# EAGLE design moth_v1 (EAGLE 9.4.1)
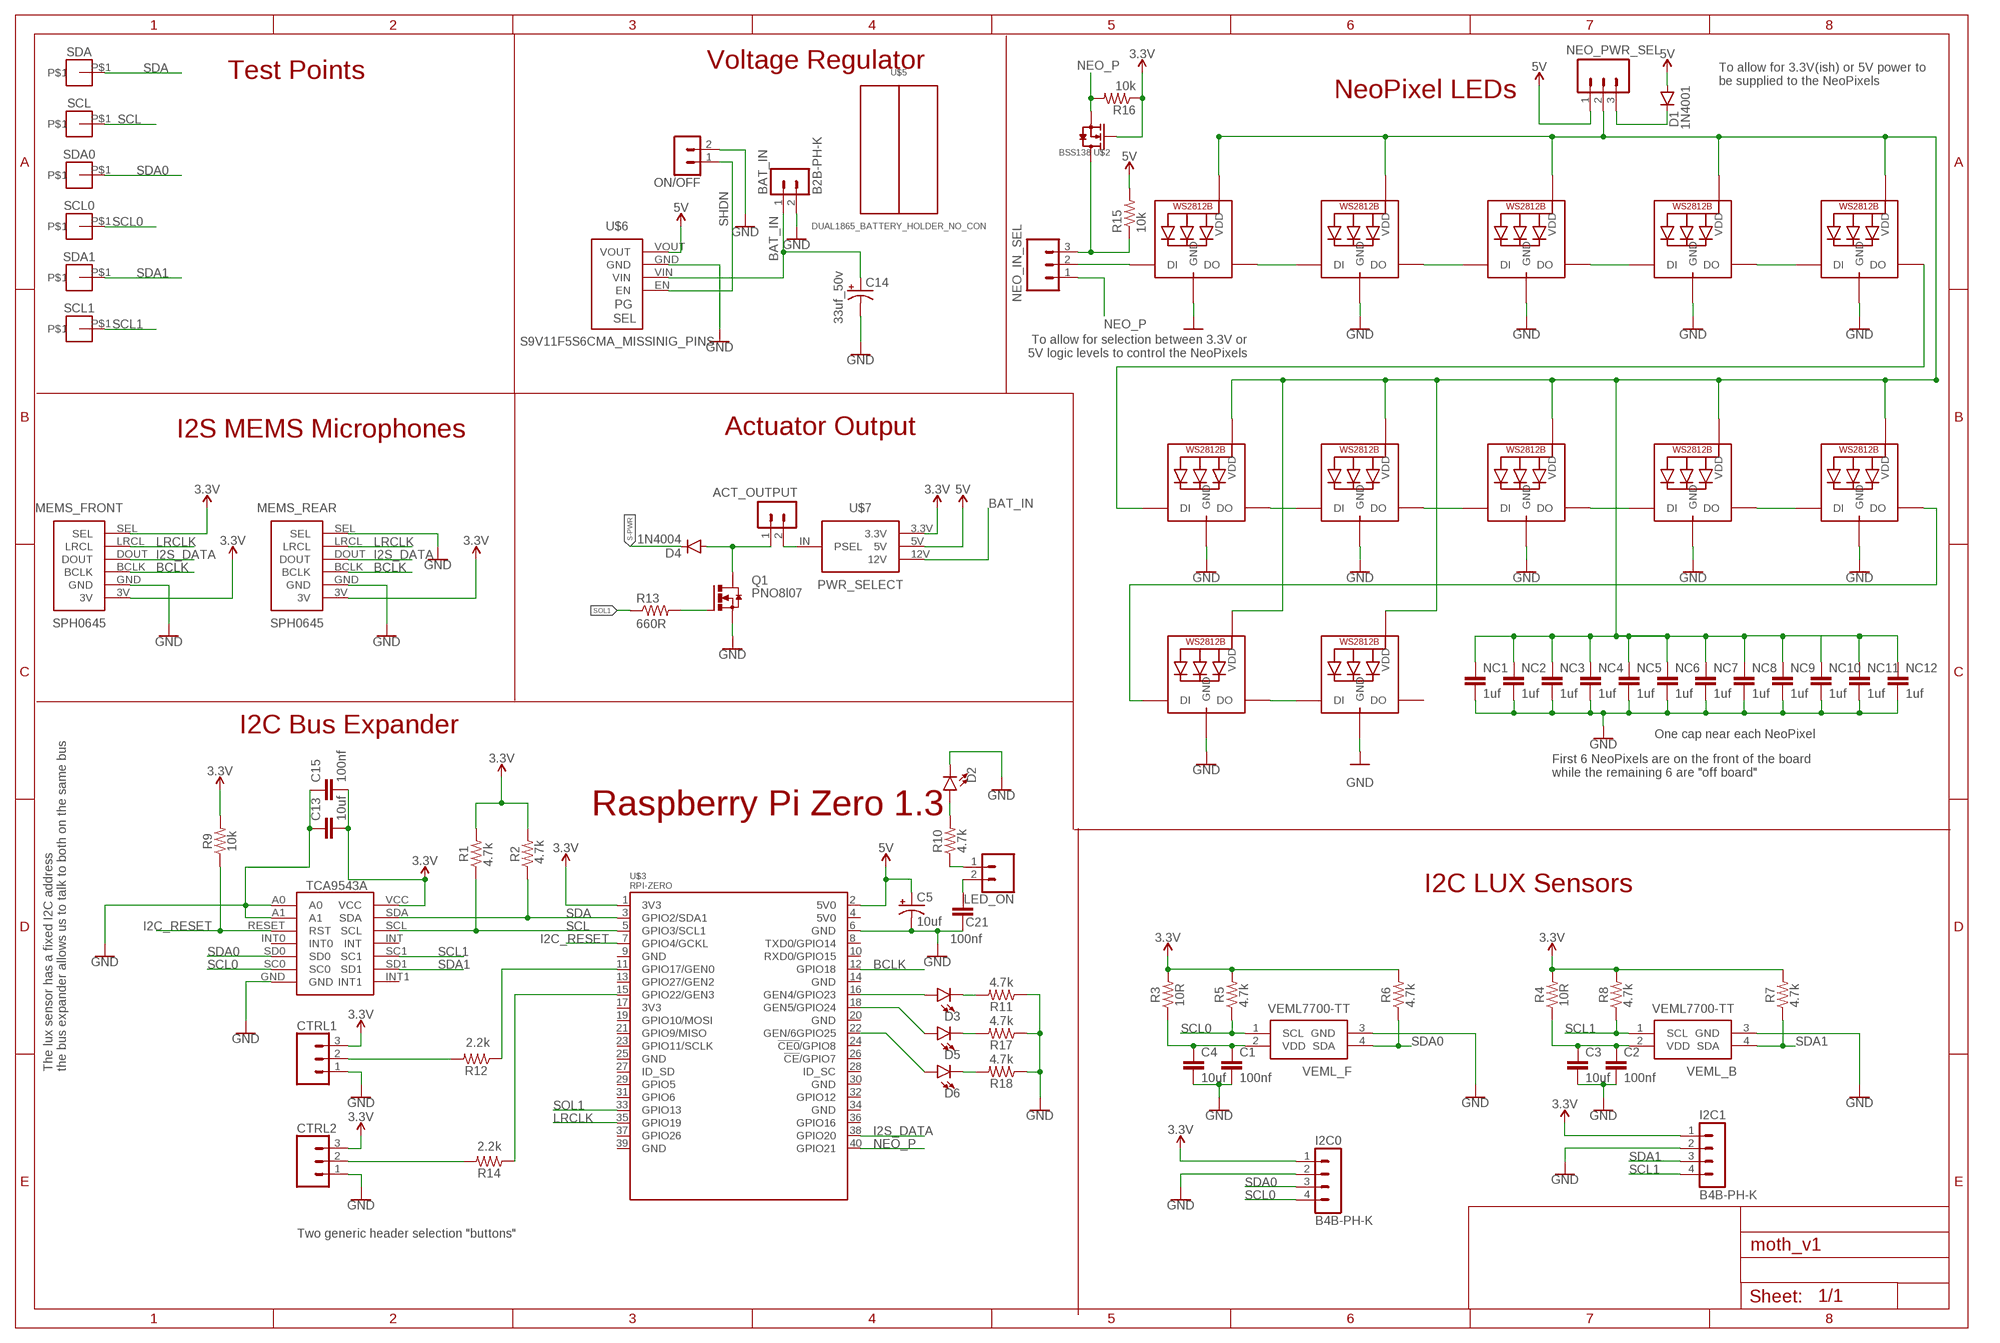
[diagram p0: schematic, sheet 1]

## Parts
ACT_OUTPUT  B2B-PH-K  [B2B-PH-K]
BAT_IN  B2B-PH-K  [B2B-PH-K]
C1  100nf  5.6PF-0603-50V-5%  [0603]
C2  100nf  5.6PF-0603-50V-5%  [0603]
C3  10uf  5.6PF-0603-50V-5%  [0603]
C4  10uf  5.6PF-0603-50V-5%  [0603]
C5  10uf  CPOL-USE2.5-6  [E2,5-6]
C13  10uf  5.6PF-0603-50V-5%  [0603]
C14  33uf_50v  CPOL-USE2-5  [E2-5]
C15  100nf  5.6PF-0603-50V-5%  [0603]
C21  100nf  5.6PF-0603-50V-5%  [0603]
CTRL1  CONN_03  [1X03]
CTRL2  CONN_03  [1X03]
D1  1N4001  DIODEPTH  [DIODE-1N4001]
D2  LED-FKIT-1206  [FKIT-LED-1206]
D3  LED-FKIT-1206  [FKIT-LED-1206]
D4  1N4004  DIODEPTH  [DIODE-1N4001]
D5  LED-FKIT-1206  [FKIT-LED-1206]
D6  LED-FKIT-1206  [FKIT-LED-1206]
I2C0  B4B-PH-K  [B4B-PH-K]
I2C1  B4B-PH-K  [B4B-PH-K]
LED_ON  CONN_021X02_NO_SILK  [1X02_NO_SILK]
MEMS_FRONT  SPH0645  SPH0645_MEMS_MICROPHONE  [SPH0645]
MEMS_REAR  SPH0645  SPH0645_MEMS_MICROPHONE  [SPH0645]
NC1  1uf  5.6PF-0603-50V-5%  [0603]
NC2  1uf  5.6PF-0603-50V-5%  [0603]
NC3  1uf  5.6PF-0603-50V-5%  [0603]
NC4  1uf  5.6PF-0603-50V-5%  [0603]
NC5  1uf  5.6PF-0603-50V-5%  [0603]
NC6  1uf  5.6PF-0603-50V-5%  [0603]
NC7  1uf  5.6PF-0603-50V-5%  [0603]
NC8  1uf  5.6PF-0603-50V-5%  [0603]
NC9  1uf  5.6PF-0603-50V-5%  [0603]
NC10  1uf  5.6PF-0603-50V-5%  [0603]
NC11  1uf  5.6PF-0603-50V-5%  [0603]
NC12  1uf  5.6PF-0603-50V-5%  [0603]
NEO_01  WS2812B_5050N  [WS2812B-NARROW]
NEO_02  WS2812B_5050N  [WS2812B-NARROW]
NEO_03  WS2812B_5050N  [WS2812B-NARROW]
NEO_04  WS2812B_5050N  [WS2812B-NARROW]
NEO_05  WS2812B_5050N  [WS2812B-NARROW]
NEO_06  WS2812B_5050N  [WS2812B-NARROW]
NEO_07  WS2812B_5050N  [WS2812B-NARROW]
NEO_08  WS2812B_5050N  [WS2812B-NARROW]
NEO_09  WS2812B_5050N  [WS2812B-NARROW]
NEO_10  WS2812B_5050N  [WS2812B-NARROW]
NEO_11  WS2812B_5050N  [WS2812B-NARROW]
NEO_12  WS2812B_5050N  [WS2812B-NARROW]
NEO_IN_SEL  CONN_03  [1X03]
NEO_PWR_SEL  CONN_03  [1X03]
ON/OFF  B2B-PH-K  [B2B-PH-K]
Q1  PNO8l07  IRF3704-H  [TO220BH]
R1  4.7k  R-US_0207/10  [0207/10]
R2  4.7k  R-US_0207/10  [0207/10]
R3  10R  4.7KOHM-0603-1/10W-1%  [0603]
R4  10R  4.7KOHM-0603-1/10W-1%  [0603]
R5  4.7k  R-US_0207/10  [0207/10]
R6  4.7k  R-US_0207/10  [0207/10]
R7  4.7k  R-US_0207/10  [0207/10]
R8  4.7k  R-US_0207/10  [0207/10]
R9  10k  R-US_0207/10  [0207/10]
R10  4.7k  4.7KOHM-0603-1/10W-1%  [0603]
R11  4.7k  4.7KOHM-0603-1/10W-1%  [0603]
R12  2k  R-US_0207/10  [0207/10]
R13  660R  R-US_0207/10  [0207/10]
R14  2k  R-US_0207/10  [0207/10]
R15  10k  10KOHM-0603-1/10W-1%  [0603]
R16  10k  10KOHM-0603-1/10W-1%  [0603]
R17  4.7k  4.7KOHM-0603-1/10W-1%  [0603]
R18  4.7k  4.7KOHM-0603-1/10W-1%  [0603]
SCL  TEST_POINT_LARGE  [TEST_POINT_LARGE]
SCL0  TEST_POINT_LARGE  [TEST_POINT_LARGE]
SCL1  TEST_POINT_LARGE  [TEST_POINT_LARGE]
SDA  TEST_POINT_LARGE  [TEST_POINT_LARGE]
SDA0  TEST_POINT_LARGE  [TEST_POINT_LARGE]
SDA1  TEST_POINT_LARGE  [TEST_POINT_LARGE]
U$1  TCA9543A  [SO14]
U$2  BSS138  [SOT23-3]
U$3  RPI-ZERO  [RASPBERRYPI_BASTELSTUBE_V13_RASPI_BOARD_B+_FULL]
U$5  DUAL1865_BATTERY_HOLDER_NO_CON  [DUAL_18650_BAT_HOLDER_NO_CON]
U$6  S9V11F5S6CMA_MISSINIG_PINS  [S9V11F3S5CMA_MISSING_PINS]
U$7  PWR_SELECT  [PWR_SELECT_PINOUT]
VEML_B  VEML7700-TT  [VEML7700]
VEML_F  VEML7700-TT  [VEML7700]

## Nets
3.3V: C13.2 C15.2 CTRL1.3 CTRL2.3 I2C0.1 I2C1.1 MEMS_FRONT.3V MEMS_FRONT.SEL MEMS_REAR.3V R1.2 R2.2 R3.2 R4.2 R5.2 R6.2 R7.2 R8.2 R9.2 R16.1 U$1.VCC U$2.1(G) U$3.1(3V3) U$7.3.3V
5V: C5.+ D1.A NEO_PWR_SEL.1 R15.2 U$3.2(5V0) U$6.VOUT U$7.5V
BAT_IN: BAT_IN.1 C14.+ U$6.VIN U$7.12V
BCLK: MEMS_FRONT.BCLK MEMS_REAR.BCLK U$3.12(GPIO18)
GND: BAT_IN.2 C1.2 C2.2 C3.2 C4.2 C5.- C13.1 C14.- C15.1 C21.1 CTRL1.1 CTRL2.1 D2.C I2C0.2 I2C1.2 MEMS_FRONT.GND MEMS_REAR.GND MEMS_REAR.SEL NC1.2 NC2.2 NC3.2 NC4.2 NC5.2 NC6.2 NC7.2 NC8.2 NC9.2 NC10.2 NC11.2 NC12.2 NEO_01.3-GND(GND) NEO_02.3-GND(GND) NEO_03.3-GND(GND) NEO_04.3-GND(GND) NEO_05.3-GND(GND) NEO_06.3-GND(GND) NEO_07.3-GND(GND) NEO_08.3-GND(GND) NEO_09.3-GND(GND) NEO_10.3-GND(GND) NEO_11.3-GND(GND) NEO_12.3-GND(GND) ON/OFF.2 Q1.S R11.1 R17.1 R18.1 U$1.A0 U$1.A1 U$1.GND U$3.6(GND) U$6.GND VEML_B.3(GND) VEML_F.3(GND)
I2C_RESET: R9.1 U$1.RESET(RST) U$3.7(GPIO4/GCKL)
I2S_DATA: MEMS_FRONT.DOUT MEMS_REAR.DOUT U$3.38(GPIO20)
LRCLK: MEMS_FRONT.LRCL MEMS_REAR.LRCL U$3.35(GPIO19)
N$1: C1.1 C4.1 R3.1 VEML_F.2(VDD)
N$2: C2.1 C3.1 R4.1 VEML_B.2(VDD)
N$3: R12.1 U$3.11(GPIO17/GEN0)
N$4: NEO_02.2-DOUT(DO) NEO_03.4-DIN(DI)
N$5: NEO_05.2-DOUT(DO) NEO_06.4-DIN(DI)
N$6: NEO_11.2-DOUT(DO) NEO_12.4-DIN(DI)
N$8: NEO_04.2-DOUT(DO) NEO_05.4-DIN(DI)
N$9: NC1.1 NC2.1 NC3.1 NC4.1 NC5.1 NC6.1 NC7.1 NC8.1 NC9.1 NC10.1 NC11.1 NC12.1 NEO_01.1-VDD(VDD) NEO_02.1-VDD(VDD) NEO_03.1-VDD(VDD) NEO_04.1-VDD(VDD) NEO_05.1-VDD(VDD) NEO_06.1-VDD(VDD) NEO_07.1-VDD(VDD) NEO_08.1-VDD(VDD) NEO_09.1-VDD(VDD) NEO_10.1-VDD(VDD) NEO_11.1-VDD(VDD) NEO_12.1-VDD(VDD) NEO_PWR_SEL.2
N$10: NEO_03.2-DOUT(DO) NEO_04.4-DIN(DI)
N$11: NEO_07.2-DOUT(DO) NEO_08.4-DIN(DI)
N$12: NEO_08.2-DOUT(DO) NEO_09.4-DIN(DI)
N$13: NEO_09.2-DOUT(DO) NEO_10.4-DIN(DI)
N$14: NEO_10.2-DOUT(DO) NEO_11.4-DIN(DI)
N$15: R14.1 U$3.15(GPIO22/GEN3)
N$16: D2.A R10.2
N$17: CTRL2.2 R14.2
N$18: CTRL1.2 R12.2
N$19: Q1.G R13.2
N$20: ACT_OUTPUT.1 D4.A Q1.D
N$23: NEO_06.2-DOUT(DO) NEO_07.4-DIN(DI)
N$24: C21.2 LED_ON.2
N$25: D1.C NEO_PWR_SEL.3
N$26: NEO_IN_SEL.3 R15.1 U$2.3(D)
N$27: LED_ON.1 R10.1
N$28: D3.C R11.2
N$29: D5.C R17.2
N$30: D6.C R18.2
N$32: D3.A U$3.16(GEN4/GPIO23)
N$33: D5.A U$3.18(GEN5/GPIO24)
N$34: D6.A U$3.22(GEN/6GPIO25)
NEO_P: NEO_IN_SEL.1 R16.2 U$2.2(S) U$3.40(GPIO21)
NEO_P1: NEO_01.2-DOUT(DO) NEO_02.4-DIN(DI)
NEO_P99: NEO_01.4-DIN(DI) NEO_IN_SEL.2
S-PWR: ACT_OUTPUT.2 D4.C U$7.IN(PSEL)
SCL: R1.1 SCL.P$1 U$1.SCL U$3.5(GPIO3/SCL1)
SCL0: I2C0.4 R5.1 SCL0.P$1 U$1.SC0 VEML_F.1(SCL)
SCL1: I2C1.4 R8.1 SCL1.P$1 U$1.SC1 VEML_B.1(SCL)
SDA: R2.1 SDA.P$1 U$1.SDA U$3.3(GPIO2/SDA1)
SDA0: I2C0.3 R6.1 SDA0.P$1 U$1.SD0 VEML_F.4(SDA)
SDA1: I2C1.3 R7.1 SDA1.P$1 U$1.SD1 VEML_B.4(SDA)
SHDN: ON/OFF.1 U$6.EN
SOL1: R13.1 U$3.33(GPIO13)
Unconnected: NEO_12.2-DOUT(DO) U$1.INT U$1.INT0 U$1.INT1 U$3.4(5V0) U$3.8(TXD0/GPIO14) U$3.9(GND) U$3.10(RXD0/GPIO15) U$3.13(GPIO27/GEN2) U$3.14(GND) U$3.17(3V3) U$3.19(GPIO10/MOSI) U$3.20(GND) U$3.21(GPIO9/MISO) U$3.23(GPIO11/SCLK) U$3.24(!CE0!/GPIO8) U$3.25(GND) U$3.26(!CE!/GPIO7) U$3.27(ID_SD) U$3.28(ID_SC) U$3.29(GPIO5) U$3.30(GND) U$3.31(GPIO6) U$3.32(GPIO12) U$3.34(GND) U$3.36(GPIO16) U$3.37(GPIO26) U$3.39(GND)

## Notes on the sheet
- Voltage Regulator
- Test Points
- To allow for 3.3V(ish) or 5V power to 
  be supplied to the NeoPixels
- NeoPixel LEDs
- To allow for selection between 3.3V or
  5V logic levels to control the NeoPixels
- I2S MEMS Microphones | Actuator Output
- 660R
- I2C Bus Expander
- One cap near each NeoPixel
- First 6 NeoPixels are on the front of the board
  while the remaining 6 are "off board"
- Raspberry Pi Zero 1.3
- 10k
- 4.7k | 4.7k
- I2C LUX Sensors
- 4.7k | 4.7k | 4.7k | 4.7k
- 2.2k
- The lux sensor has a fixed I2C address
  the bus expander allows us to talk to both on the same bus
- 2.2k
- Two generic header selection "buttons"

## Library data of the parts
ACT_OUTPUT BAT_IN ON/OFF = con-jst-ph:B2B-PH-K: HEADER
C1-C4 C13 C15 C21 NC1-NC12 = SparkFun-Capacitors:5.6PF: 5.6pF ceramic capacitors A capacitor is a passive two-terminal electrical component used to store electrical energy temporarily in an electric field.; PROD_ID: CAP-12456; VALUE: 5.6PF
C5 C14 = adafruit:CPOL-US: POLARIZED CAPACITOR, American symbol
CTRL1 CTRL2 NEO_IN_SEL NEO_PWR_SEL = SparkFun-Connectors:CONN_03: Multi connection point. Often used as Generic Header-pin footprint for 0.1 inch spaced/style header connections On any of the 0.1 inch spaced packages, you can populate with these: Break Away Headers - Straight <https://www.sparkfun.com/products/116> (PRT-00116) Break Away Male Headers - Right Angle <https://www.sparkfun.com/products/553> (PRT-00553) Female Headers <https://www.sparkfun.com/products/115> (PRT-00115) Break Away Headers - Machine Pin <https://www.sparkfun.com/products/117> (PRT-00117) Break Away Female Headers - Swiss Machine Pin <https://www.sparkfun.com/products/743> (PRT-00743) Stackable Header - 3 Pin (Female, 0.1") <https://www.sparkfun.com/products/13875> (PRT-13875) For SCREWTERMINALS and SPRING TERMINALS visit here: Screw Terimnals on SparkFun.com <https://www.sparkfun.com/search/results?term=Screw+Terminals> (5mm/3.5mm/2.54mm spacing) This device is also useful as a general connection point to wire up your design to another part of your project. Our various solder wires solder well into these plated through hole pads. Hook-Up Wire - Assortment (Stranded, 22 AWG) <https://www.sparkfun.com/products/11375> (PRT-11375) Hook-Up Wire - Assortment (Solid Core, 22 AWG) <https://www.sparkfun.com/products/11367> (PRT-11367) View the entire wire category on our website here <https://www.sparkfun.com/categories/141> Special notes: Molex polarized connector foot print use with SKU : PRT-08232 with associated crimp pins and housings.
D1 D4 = SparkFun-DiscreteSemi:DIODE: Diode These are standard reverse protection diodes and small signal diodes. SMA package can handle up to about 1A. SOD-323 can handle about 200mA. What the SOD-323 package when ordering, there are some mfgs out there that are 5-pin packages.
D2 D3 D5 D6 = SparkFun-LED:LED: LED (Generic) Standard schematic elements and footprints for 5mm, 3mm, 1206, and 0603 sized LEDs. Generic LEDs with no color specified.
I2C0 I2C1 = con-jst-ph:B4B-PH-K: HEADER
LED_ON = SparkFun-Connectors:CONN_02: Multi connection point. Often used as Generic Header-pin footprint for 0.1 inch spaced/style header connections On any of the 0.1 inch spaced packages, you can populate with these: Break Away Headers - Straight <https://www.sparkfun.com/products/116> (PRT-00116) Break Away Male Headers - Right Angle <https://www.sparkfun.com/products/553> (PRT-00553) Female Headers <https://www.sparkfun.com/products/115> (PRT-00115) Break Away Headers - Machine Pin <https://www.sparkfun.com/products/117> (PRT-00117) Break Away Female Headers - Swiss Machine Pin <https://www.sparkfun.com/products/743> (PRT-00743) For SCREWTERMINALS and SPRING TERMINALS visit here: Screw Terimnals on SparkFun.com <https://www.sparkfun.com/search/results?term=Screw+Terminals> (5mm/3.5mm/2.54mm spacing) This device is also useful as a general connection point to wire up your design to another part of your project. Our various solder wires solder well into these plated through hole pads. Hook-Up Wire - Assortment (Stranded, 22 AWG) <https://www.sparkfun.com/products/11375> (PRT-11375) Hook-Up Wire - Assortment (Solid Core, 22 AWG) <https://www.sparkfun.com/products/11367> (PRT-11367) View the entire wire category on our website here <https://www.sparkfun.com/categories/141> Special notes: Molex polarized connector foot print use with: PRT-08233 with associated crimp pins and housings. 2.54_SCREWTERM for use with PRT-10571. 3.5mm Screw Terminal footprints for PRT-08084 5mm Screw Terminal footprints for use with PRT-08432
MEMS_FRONT MEMS_REAR = nathans-custom-parts:SPH0645_MEMS_MICROPHONE
NEO_01-NEO_09 NEO_10-NEO_12 = adafruit:WS2812B
Q1 = transistor-power:IRF3704: SMPS MOSFET HEXFET® Power MOSFET Source: http://www.irf.com/product-info/datasheets/data/irf3704.pdf
R1 R2 R5-R9 R12-R14 = adafruit:R-US_: RESISTOR, American symbol
R3 R4 = SparkFun-Resistors:4.7KOHM: 4.7kΩ resistor A resistor is a passive two-terminal electrical component that implements electrical resistance as a circuit element. Resistors act to reduce current flow, and, at the same time, act to lower voltage levels within circuits. - Wikipedia; PROD_ID: RES-07857; VALUE: 4.7k
R10 R11 R17 R18 = SparkFun-Resistors:4.7KOHM: 4.7kΩ resistor A resistor is a passive two-terminal electrical component that implements electrical resistance as a circuit element. Resistors act to reduce current flow, and, at the same time, act to lower voltage levels within circuits. - Wikipedia; PROD_ID: RES-07857
R15 R16 = SparkFun-Resistors:10KOHM: 10kΩ resistor A resistor is a passive two-terminal electrical component that implements electrical resistance as a circuit element. Resistors act to reduce current flow, and, at the same time, act to lower voltage levels within circuits. - Wikipedia; PROD_ID: RES-00824
SCL SCL0 SCL1 SDA SDA0 SDA1 = nathans-custom-parts:TEST_POINT_LARGE
U$1 = nathans-custom-parts:TCA9543A
U$2 = nathans-custom-parts:BSS138
U$3 = RPI-Zero:RPI-ZERO
U$5 = nathans-custom-parts:DUAL1865_BATTERY_HOLDER_NO_CON
U$6 = nathans-custom-parts:S9V11F5S6CMA_MISSINIG_PINS
U$7 = nathans-custom-parts:PWR_SELECT
VEML_B VEML_F = VEML7700-TT:VEML7700-TT: 16Bit Ambient Light Sensor I2C 6.8x2.3mm Source: Datasheet <https://www.arrow.com/en/products/veml7700-tt/vishay>; DESCRIPTION: 16Bit Ambient Light Sensor I2C 6.8x2.3mm; HEIGHT: mm; MANUFACTURER_NAME: Vishay; MANUFACTURER_PART_NUMBER: VEML7700-TT; MOUSER_PART_NUMBER: 78-VEML7700-TT; MOUSER_PRICE-STOCK: https://www.mouser.com/Search/Refine.aspx?Keyword=78-VEML7700-TT; RS_PART_NUMBER: 1226791P; RS_PRICE-STOCK: http://uk.rs-online.com/web/p/products/1226791P

## Net classes
0 default: width 0.203 mm, drill 0.254 mm, clearance 0.203 mm

## Board
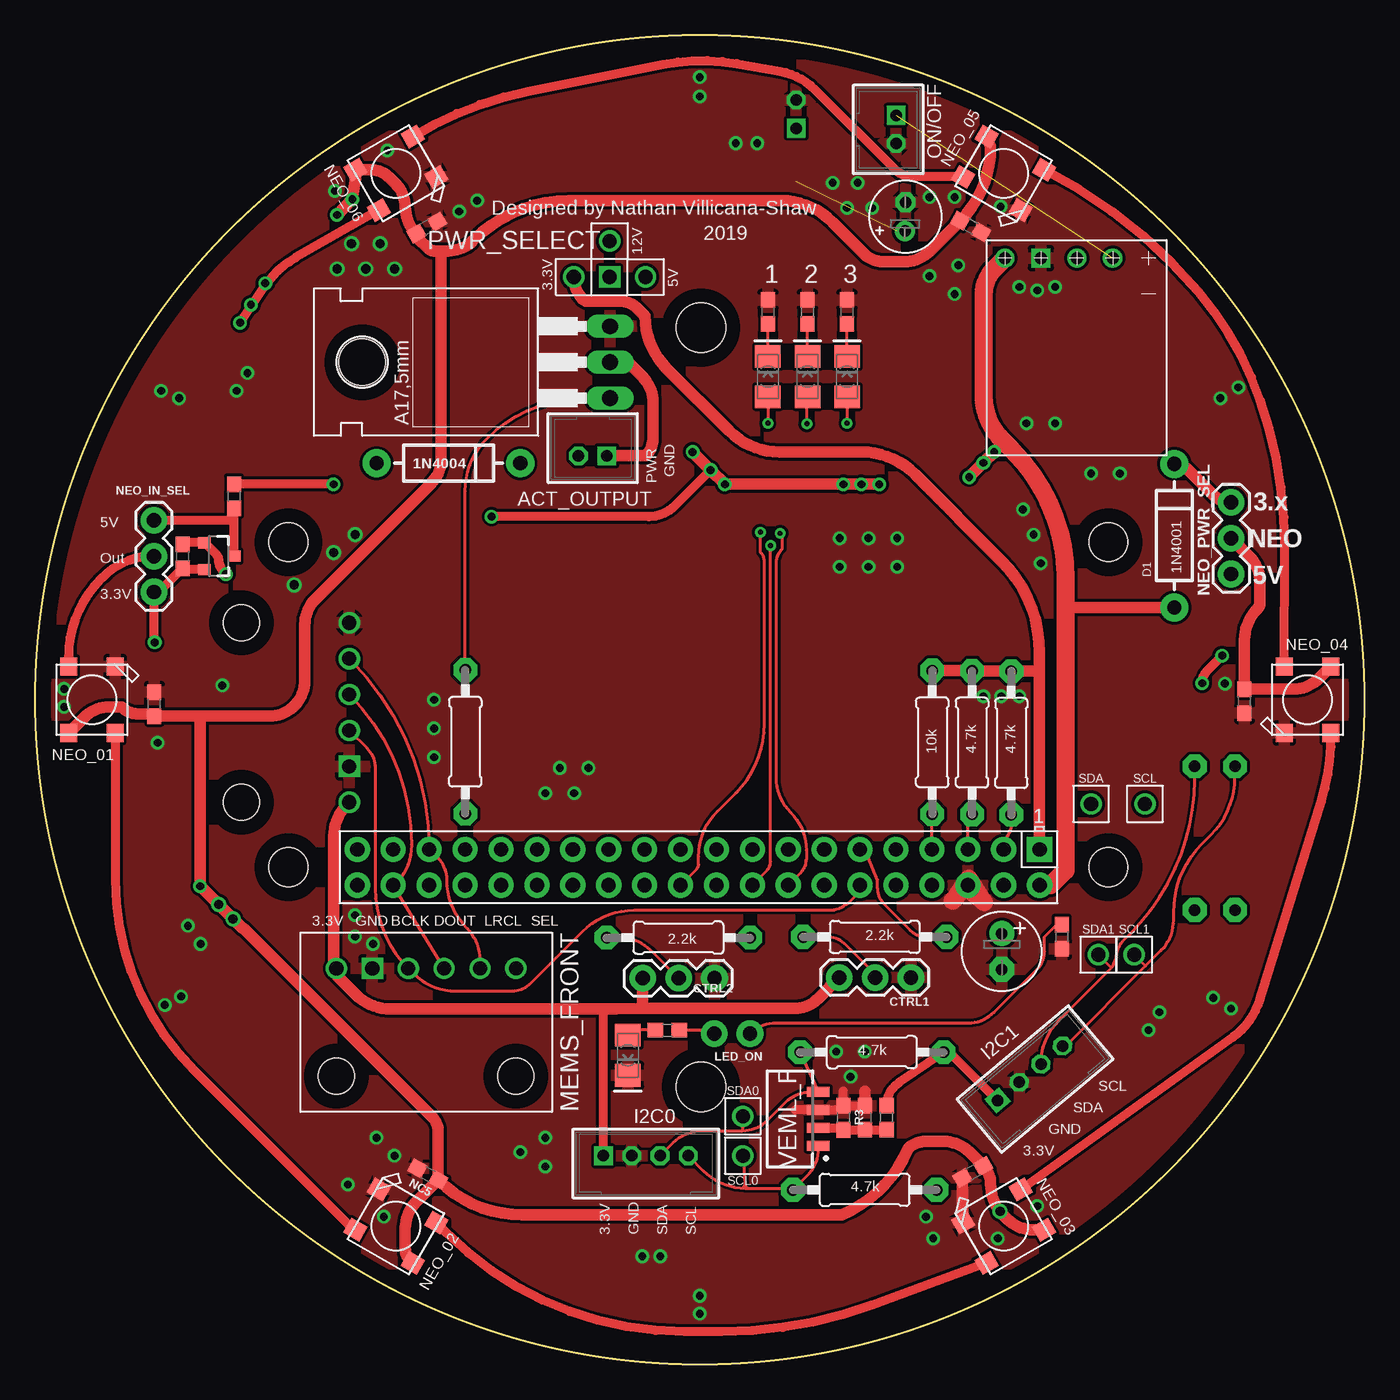
[diagram p1: board, top side]
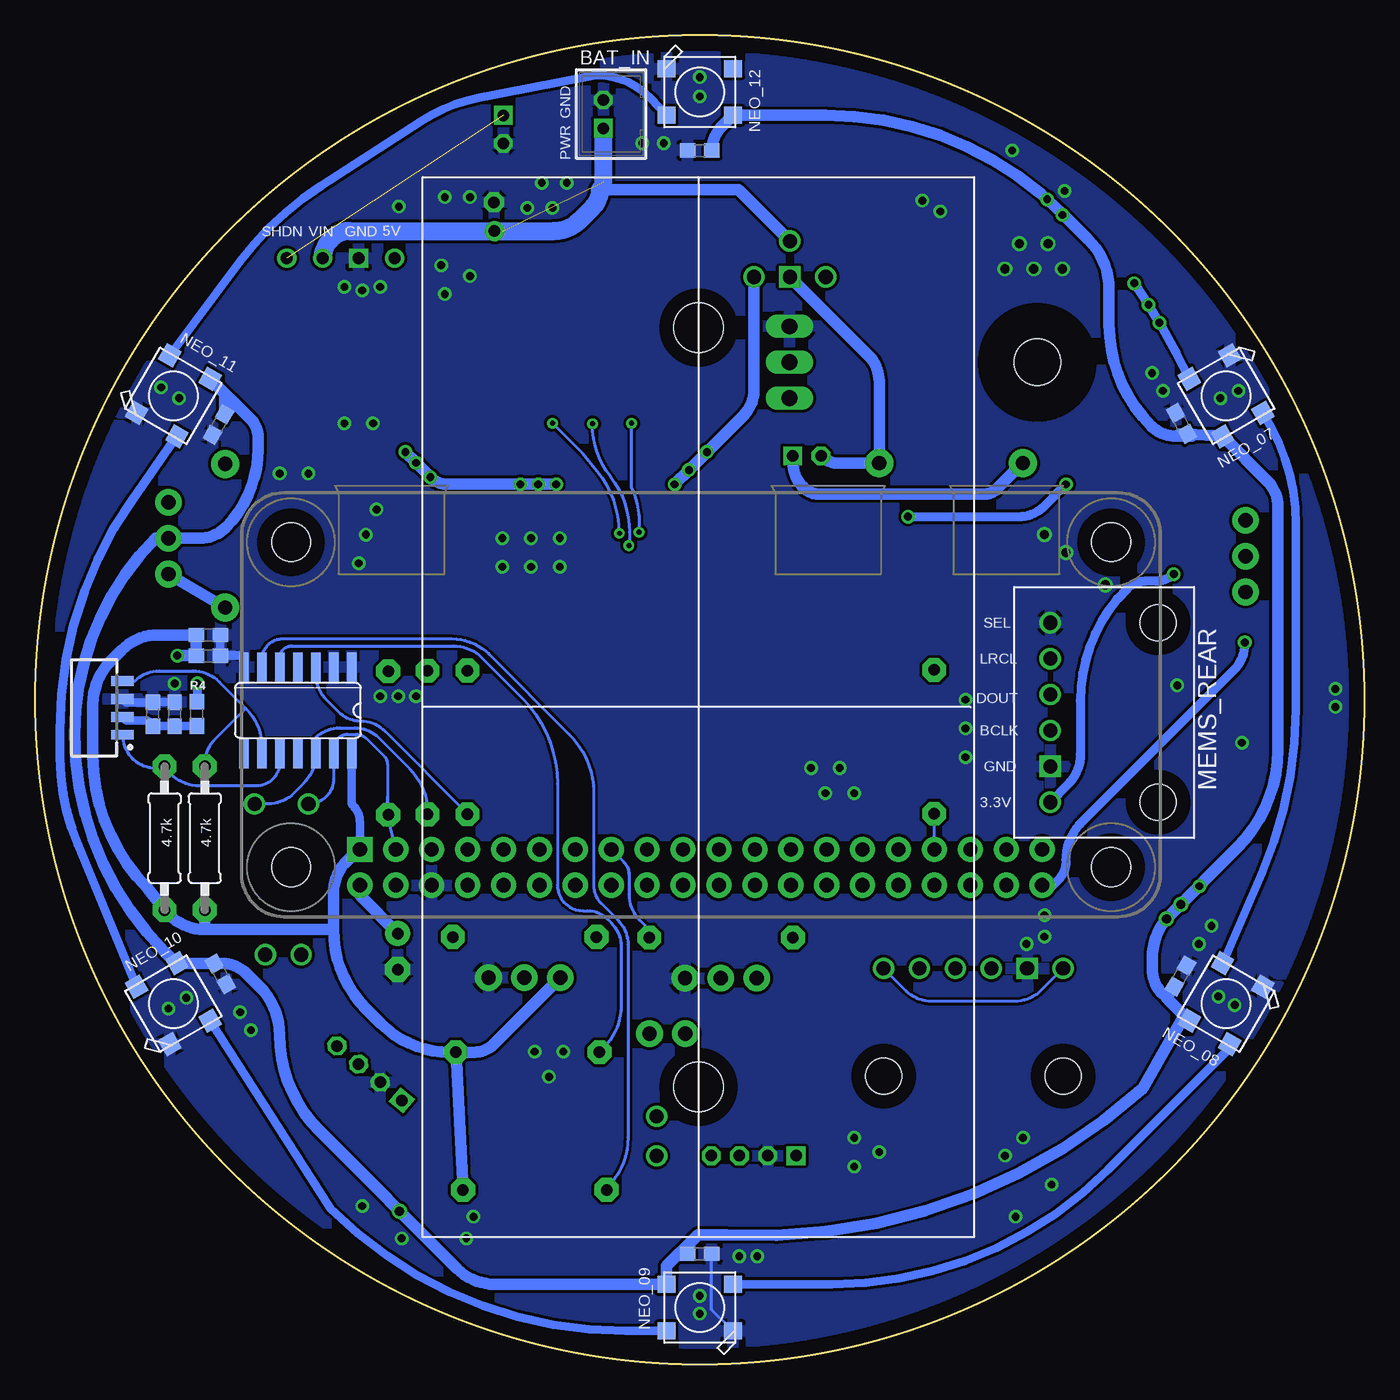
[diagram p2: board, bottom side, seen from below]

Size 94 x 94 mm. Coordinates in mm from the lower left corner, seen from the top.
Outline: circle at 47,47 radius 47
Copper layers (1*16): Top 0.035mm / dielectric 1.5mm / Bottom 0.035mm
Design rules "PCBway *": minimum track width 6mil, minimum drill 0.3mm, track to track 0.205mm, track to pad 0.205mm, pad to pad 0.205mm, via to via 0.205mm, smd to smd 8mil, copper to edge 40mil, drill to drill 8mil, minimum pad ring 10mil, minimum via ring 8mil, stop-mask expansion 4mil, vias tented up to drill 25mil, thermal gap 10mil

### Footprints (pad centres in the part's own frame; a part is rotated, then mirrored left to right if it is on the bottom)
B2B-PH-K = drill 0.813 square: 1 -1,0 | drill 0.813 octagon: 2 1,0
0603 = smd 1.1 x 1: 1 -0.85,0; 2 0.85,0
E2,5-6 = drill 0.813 pad 1.778: + -1.27,0 | drill 0.813 pad 1.778 octagon: - 1.27,0
E2-5 = drill 0.813 pad 1.422: + -1.016,0 | drill 0.813 pad 1.422 octagon: - 1.016,0
1X03 = drill 1.016 pad 1.88: 1 0,0; 2 2.54,0; 3 5.08,0
DIODE-1N4001 = drill 1 pad 1.981: A -5.08,0; C 5.08,0
FKIT-LED-1206 = smd 1.6 x 1.803: A -1.422,0; C 1.422,0
B4B-PH-K = drill 0.813 square: 1 -3,0 | drill 0.813 octagon: 2 -1,0; 3 1,0; 4 3,0
1X02_NO_SILK = drill 1.016 pad 1.88: 1 0,0; 2 2.54,0
SPH0645 = drill 1: 3V 12.7,0; BCLK 7.62,0; DOUT 5.08,0; LRCL 2.54,0; SEL 0,0 | drill 1 square: GND 10.16,0 | hole 2.54: 0,7.62; 12.7,7.62
WS2812B-NARROW = smd 1.3 x 1.2: 1-VDD 2.35,-1.65; 2-DOUT 2.35,1.65; 3-GND -2.35,1.65; 4-DIN -2.35,-1.65
TO220BH = drill 1.118 long: D 0,-6.35; G -2.54,-6.35; S 2.54,-6.35 | hole 3.302: 0,11.176
0207/10 = drill 0.813 pad 1.676 octagon: 1 -5.08,0; 2 5.08,0
TEST_POINT_LARGE = drill 1: P$1 0,0
SO14 = smd 0.66 x 2.032: A0 -3.81,-3.073; A1 -2.54,-3.073; GND 3.81,-3.073; INT 0,3.073; INT0 0,-3.073; INT1 3.81,3.073; RESET -1.27,-3.073; SC0 2.54,-3.073; SC1 1.27,3.073; SCL -1.27,3.073; SD0 1.27,-3.073; SD1 2.54,3.073; SDA -2.54,3.073; VCC -3.81,3.073
SOT23-3 = smd 0.8 x 0.9: 1 -0.95,-1; 2 0.95,-1; 3 0,1.1
RASPBERRYPI_BASTELSTUBE_V13_RASPI_BOARD_B+_FULL = drill 1 pad 1.778 square: 1 8.37,25.23 | drill 1 pad 1.778: 2 8.37,27.77; 3 10.91,25.23; 4 10.91,27.77; 5 13.45,25.23; 6 13.45,27.77; 7 15.99,25.23; 8 15.99,27.77; 9 18.53,25.23; 10 18.53,27.77; 11 21.07,25.23; 12 21.07,27.77; 13 23.61,25.23; 14 23.61,27.77; 15 26.15,25.23; 16 26.15,27.77; 17 28.69,25.23; 18 28.69,27.77; 19 31.23,25.23; 20 31.23,27.77; 21 33.77,25.23; 22 33.77,27.77; 23 36.31,25.23; 24 36.31,27.77; 25 38.85,25.23; 26 38.85,27.77; 27 41.39,25.23; 28 41.39,27.77; 29 43.93,25.23; 30 43.93,27.77; 31 46.47,25.23; 32 46.47,27.77; 33 49.01,25.23; 34 49.01,27.77; 35 51.55,25.23; 36 51.55,27.77; 37 54.09,25.23; 38 54.09,27.77; 39 56.63,25.23; 40 56.63,27.77 | hole 2.75: 3.5,3.5; 3.5,26.5; 61.5,3.5; 61.5,26.5
DUAL_18650_BAT_HOLDER_NO_CON = hole 3.5: 19.674,64.255; 19.674,10.555
S9V11F3S5CMA_MISSING_PINS = drill 0.85: EN 0,0; VIN 2.54,0; VOUT 7.62,0 | drill 0.85 square: GND 5.08,0
PWR_SELECT_PINOUT = drill 1: 3.3V 0,5.08; 5V 0,0; 12V 2.54,2.54 | drill 1 square: IN 0,2.54
VEML7700 = smd 0.7 x 1.6: 1 1.495,-0.4; 2 2.765,-0.4; 3 4.035,-0.4; 4 5.305,-0.4

### Placement (x,y rotation side)
ACT_OUTPUT  39.42,64.26 180 top
BAT_IN  53.82,88.43 90 bottom
C1  58.69,17.43 90 top
C2  85.68,45.99 90 bottom
C3  84.13,45.99 90 bottom
C4  57.16,17.42 90 top
C5  68.36,29.19 270 top
C13  81.76,50.11 180 bottom
C14  61.53,81.17 89 top
C15  81.76,51.58 180 bottom
C21  72.61,30.24 90 top
CTRL1  61.94,27.35 180 top
CTRL2  48.05,27.29 180 top
D1  80.58,58.61 90 top
D2  41.92,21.85 270 top
D3  57.41,69.86 90 top
D4  29.23,63.73 0 top
D5  54.62,69.86 90 top
D6  51.83,69.86 90 top
I2C0  43.19,14.74 0 top
I2C1  70.37,20.58 40 top
LED_ON  48.02,23.38 0 top
MEMS_FRONT  34,28 180 top
MEMS_REAR  22.21,52.45 270 bottom
NC1  85.53,46.91 270 top
NC2  66.17,80.48 331 top
NC3  27.69,80.4 30 top
NC4  8.42,46.69 90 top
NC5  27.76,13.44 151 top
NC6  66.31,13.6 210 top
NC7  81.04,66.47 240 bottom
NC8  47,85.86 180 bottom
NC9  12.93,66.55 119 bottom
NC10  12.99,27.46 60 bottom
NC11  47.01,7.81 0 bottom
NC12  80.92,27.61 300 bottom
NEO_01  4,47 270 top
NEO_02  25.5,9.76 330 top
NEO_03  68.5,9.76 30 top
NEO_04  90,47 90 top
NEO_05  68.5,84.24 150 top
NEO_06  25.5,84.24 210 top
NEO_07  9.76,68.5 300 bottom
NEO_08  9.76,25.5 240 bottom
NEO_09  47,4 180 bottom
NEO_10  84.24,25.5 120 bottom
NEO_11  84.24,68.5 60 bottom
NEO_12  47,90 0 bottom
NEO_IN_SEL  8.39,54.62 90 top
NEO_PWR_SEL  84.59,55.89 90 top
ON/OFF  60.89,87.35 270 top
Q1  34.3,70.88 90 top
R1  66.26,43.97 90 top
R2  69.04,43.94 90 top
R3  60.22,17.45 90 top
R4  82.57,45.99 90 bottom
R5  58.67,12.33 0 top
R6  59.17,22.07 0 top
R7  82.02,37.21 270 bottom
R8  84.86,37.21 270 bottom
R9  63.45,43.99 90 top
R10  44.71,23.63 180 top
R11  57.41,74.43 270 top
R12  59.38,30.22 180 top
R13  30.41,44.02 90 top
R14  45.49,30.17 180 top
R15  14.06,61.4 90 top
R16  10.42,57.16 270 top
R17  54.62,74.43 270 top
R18  51.83,74.43 270 top
SCL  78.5,39.63 0 top
SCL0  50.05,14.74 0 top
SCL1  77.73,28.97 0 top
SDA  74.69,39.63 0 top
SDA0  50.05,17.54 0 top
SDA1  75.19,28.97 0 top
U$1  75.43,46.24 180 bottom
U$2  12.96,57.16 270 top
U$3  79.41,61.65 180 top
U$5  27.42,83.88 180 bottom
U$6  76.21,78.24 180 top
U$7  43.17,76.91 90 top
VEML_B  88.23,43.03 90 bottom
VEML_F  54.98,13.95 90 top

### Tracks (layer width: path | path; a pad name or v marks a point on that pad's centre or on a via)
3.3V  (via drill 0.55)
  Top 0.635: R3.2 arc-56 61.06,19.88 R6.2 64.66,22.07 I2C1.1 | 82.93,49.1 arc45 v82.55,48.17 arc-45 82.93,49.1 | 82.93,49.1 v83.96,50.12 | R16.1 arc-45 10.66,58.11 U$2.1 12.82,57.25 arc-45 12.96,56.91 arc45 13.32,56.04 v13.47,55.89 | I2C0.1 40.19,25.13 39.15,25.13 39.14,25.14
  Top 0.813: MEMS_REAR.3V 22.04,39.58 arc45 21.11,37.33 21.11,28.19 MEMS_FRONT.3V 21.3,27.52 22.66,26.16 arc45 25.14,25.13 39.15,25.13 | 39.14,25.14 41.08,25.14 42.97,25.17 | CTRL1.3 55.38,25.87 arc-45 53.69,25.17 42.97,25.17 | U$7.3.3V arc45 38.75,75.32 arc45 39.05,75.19 41.37,75.19 arc-45 42.57,74.7 43.13,74.14 arc45 44.66,70.44 49.09,66.01 arc45 52.67,64.53 58.42,64.53 arc-45 62.22,62.96 68.34,56.83 arc-45 71.04,50.31 71.04,48.78 | 71.04,48.78 U$3.1 | R9.2 66.24,49.07 R1.2 69.01,49.05 R2.2 70.8,49.02 71.04,48.78 | CTRL2.3 42.97,25.17
  Bottom 0.203: MEMS_FRONT.3V 22.89,26.41 arc45 24.69,25.66 30.61,25.66 arc45 32.41,26.41 MEMS_FRONT.SEL
  Bottom 0.61: U$1.VCC 71.62,39.71 arc-45 71.55,39.54 arc45 71.04,38.32 U$3.1
  Bottom 0.635: R4.2 arc-45 82.56,46.87 82.56,48.14 arc45 v82.55,48.17 | v13.47,55.89 arc45 14.7,55.38 15.5,55.38 arc-45 16.8,54.84 arc-45 20.08,46.95 20.08,43.13 arc45 20.96,40.99 MEMS_REAR.3V
  Bottom 0.813: 64.26,22.06 R6.2 arc45 R6.2 | 72.91,30.74 72.91,33.29 arc45 71.95,35.61 71.2,36.35 arc45 U$3.1 | 72.91,30.74 arc-45 70.57,25.11 69.54,24.07 arc-45 64.71,22.07 R6.2 | R6.2 62.93,22.07 arc-45 61.57,22.63 CTRL1.3 | v83.96,50.12 83.94,50.11 C13.2 arc45 C13.2 C15.2 85.33,51.58 arc-45 87.89,50.52 88.65,49.76 arc-45 89.93,46.69 89.93,43.03 arc-45 86.05,33.66 R8.2 84.48,31.75 arc-45 82.05,30.74 | 72.91,30.74 82.05,30.74 | R7.2 82.02,30.78 82.05,30.74 | R6.2 R5.2
5V  (via drill 0.55)
  Top 0.635: v47.76,63.26 45.2,60.7 arc-45 43.41,59.95 v32.27,59.95 | v21.09,62.24 14.09,62.24 arc-45 R15.2
  Top 0.813: D1.A 72.94,53.53 72.87,53.6 | v66.05,62.75 v67.07,63.76 v67.83,64.53 68.23,64.93 arc45 68.41,65.36 | v46.49,64.53 v47.76,63.26 v48.78,62.24 v57.16,62.24 v58.43,62.24 v59.7,62.24
  Top 1.27: U$3.2 71.43,33.88 71.45,33.87 71.81,33.87 72.87,34.92 72.87,53.6 72.87,55.52 arc45 69.07,64.7 68.41,65.36 arc-45 67.09,68.53 67.09,75.69 arc-45 67.84,77.49 U$6.VOUT
  Bottom 0.635: v32.27,59.95 24.43,59.95 arc-45 22.63,60.7 v21.09,62.24
  Bottom 0.813: C5.+ 71.04,33.14 U$3.2 | v48.78,62.24 v47.76,63.26 v46.49,64.53 43.91,67.11 arc-45 43.17,68.9 U$7.5V | v57.16,62.24 v58.43,62.24 v59.7,62.24 64.82,62.24 arc45 v66.05,62.75 v67.07,63.76 v67.83,64.53 | D1.A NEO_PWR_SEL.1
BAT_IN  (1 unrouted)
  Bottom 0.813: U$7.12V 44.23,83.05 arc-45 44.27,83.07 54.06,83.07 | C14.+ 60.94,80.16
  Bottom 1.27: 54.06,83.07 arc45 54.56,81.85 55.52,80.9 arc45 57.31,80.16 C14.+ 71.82,80.16 arc-45 73.01,79.67 73.13,79.54 arc-45 U$6.VIN | 53.82,83.65 BAT_IN.1
BCLK
  Top 0.203: U$3.12 58.34,33.45 57.64,32.75 arc-45 56.11,32.12 42.36,32.12 arc45 38.71,30.6 35.04,26.94 arc-45 33.74,26.4 29.7,26.4 arc-45 26.76,27.62 MEMS_FRONT.BCLK arc-45 24.04,33.65 24.04,42.17 arc45 23.45,43.58 MEMS_REAR.BCLK
GND  (via drill 0.55, 0.65)
  Top 0.203: 58.67,18.27 arc45 C1.2 | 65.8,33.79 arc45 65.93,33.85 U$3.6 65.8,34.04 arc-45 65.8,34.05
  Top 0.635: 58.68,18.27 C1.2 | 53.75,17.98 VEML_F.3 56.46,17.98 arc45 C4.2 | C4.2 58.67,18.27 | C4.2 arc-45 57.16,18.28 57.16,19.31
  Top 0.813: NEO_03.3-GND 65.58,10.08 NC6.2 | C1.2 arc-45 C1.2 58.68,19.31
  Top 1.27: 65.8,34.05 64.89,32.78 | 65.8,33.79 66.94,32.89 | 66.04,34.34 67.12,32.67
  Bottom 0.203: NEO_09.3-GND 46.16,3.86 NC11.2
  Bottom 0.61: VEML_B.3 87.57,46.81 85.71,46.81 C2.2 C3.2 | C15.1 80.92,51.57 C13.1
  Bottom 0.635: U$1.GND arc45 79.26,49.36 79.26,50.05 arc-45 79.41,50.11 C13.1
  other vias: 83.32,25.92 84.59,25.16 79.51,24.9 78.75,23.63 44.21,7.63 42.94,7.63 47,4.84 47,3.57 11.69,29.73 10.31,26.01 9.15,25.41 10.79,31.01 8.9,68.84 10.17,68.34 14.23,68.84 15,70.11 47,91.04 47,89.67 49.54,86.37 51.06,86.37 69.61,76.21 70.88,75.96 72.15,76.21 83.83,68.34 85.1,69.1 2.04,47.76 2.04,46.49 8.65,43.95 13.22,48.02 25.41,14.74 24.14,16.01 22.11,12.71 24.65,10.42 24.9,85.86 21.19,82.99 29.98,81.54 31.25,82.31 56.4,83.58 68.29,81.89 63.26,76.97 65.29,77.73 70.88,11.19 68.08,8.9 63,10.42 63.51,8.9 67.07,47.25 68.34,47.25 69.61,47.25 84.15,48.14 22.62,31.76 22.62,30.24 57.41,81.8 59.19,81.8 58.18,83.58 65.03,75.7 63.26,82.56 65.03,82.56 21.35,77.48 23.38,77.48 25.41,77.48 24.39,79.26 22.36,79.26 22.62,58.68 21.09,57.41 18.3,55.13 70.11,66.56 72.15,66.56 74.69,63 76.72,63 56.91,58.43 58.94,58.43 60.97,58.43 56.91,56.4 58.94,56.4 60.97,56.4 56.65,22.11 58.68,22.11 57.67,20.33 36.08,16.01 36.08,13.98 34.3,15 28.2,42.94 28.2,44.97 28.2,47 36.08,40.4 38.11,40.4 37.09,42.17 39.13,42.17 69.86,60.46 70.62,58.68 71.13,56.65 23.89,29.73
  pour Top: 46.5,93.97 47.14,93.97 arc-90 94.16,46.95 arc-90 47.29,0.08 arc-90 0.43,46.94 0.43,47.9 arc-90
  pour Bottom: 46.92,93.87 47.34,93.87 arc-90 94.07,47.12 arc-90 47.21,0.26 47.16,0.26 arc-90 0.23,47.43 arc-90
I2C_RESET
  Top 0.203: U$3.7 63.42,38.88 R9.1
  Bottom 0.203: R9.1 63.45,38.97 69.23,44.75 arc-45 70.98,45.48 arc45 72.54,46.12 73.37,46.95 arc45 74.16,48.86 U$1.RESET
I2S_DATA
  Top 0.203: MEMS_REAR.DOUT arc-45 26.6,36.76 26.6,36.73 arc-45 25.42,33.88 U$3.38 MEMS_FRONT.DOUT
LRCLK
  Top 0.203: MEMS_FRONT.LRCL 31.46,28.61 arc45 30.55,30.82 arc-45 29.12,34.26 arc45 28.48,35.8 U$3.35 arc45 22.32,49.8 MEMS_REAR.LRCL
N$1
  Top 0.635: R3.1 60.21,16.58 C1.1 57.17,16.58 C4.1 57.02,16.71 VEML_F.2
N$2
  Bottom 0.61: VEML_B.2 87.57,45.54 86.09,45.54 C2.1 84.31,45.14 84.22,45.22 C3.1 82.62,45.14 R4.1
N$3
  Top 0.203: U$3.11 58.95,35.81 59.59,34.27 59.59,33.67 arc45 60.07,32.51 61.9,30.68 arc45 63.03,30.21 63.95,30.21 63.95,30.22 R12.1
N$4
  Top 0.635: NEO_02.2-DOUT 29.1,9.28 arc45 45.95,2.3 48.53,2.3 arc20 59.16,4.18 NEO_03.4-DIN
N$5
  Top 0.635: NEO_05.2-DOUT 62.12,83.98 arc-45 60.76,84.55 55.14,90.16 arc35 52.68,91.45 49.61,92 arc21 44.4,91.95 34.84,90.03 arc20 NEO_06.4-DIN
N$6
  Bottom 0.61: NEO_11.2-DOUT 79.49,78.02 arc20 73.8,83.33 66.7,87.94 arc22 62.6,89.59 54.37,91.2 arc46 50.5,89.55 NEO_12.4-DIN
N$8
  Top 0.635: NEO_04.2-DOUT 88.38,57.82 arc19 86.66,68.15 arc21 82.31,75.82 arc23 NEO_05.4-DIN
N$9  (via drill 0.55, 0.65)
  Top 0.203: v68.25,10.8 68.51,10.51
  Top 0.813: NEO_01.1-VDD 3.45,45.75 arc-45 5.24,46.49 6.11,46.49 arc45 7.33,45.98 8.06,45.98 arc-45 NC4.1 11.67,45.84 | 28.71,78.75 29.18,78.75 arc45 30.98,79.49 arc-45 37.77,82.31 52.74,82.31 arc-45 56.38,80.8 58.65,78.53 arc45 59.95,77.99 61.47,77.99 arc45 63.27,78.73 NC2.1 arc45 67.57,86.08 67.57,86.16 NEO_05.1-VDD | 28.71,78.75 28.2,78.75 arc-45 27.77,78.93 27.11,79.59 arc-45 NC3.1 arc-45 26.17,81.85 arc45 25.49,83.49 25.06,83.93 arc45 23.7,84.49 NEO_06.1-VDD 22.64,83.9 v22.43,82.41 v21.35,81.29 | NC5.1 26.92,11.44 arc45 26.17,9.64 26.17,8.14 arc45 26.48,7.38 NEO_02.1-VDD | v11.66,33.8 11.67,33.82 | 11.67,33.82 v12.96,32.52 v13.98,31.51 14.67,30.82 14.73,30.82 28.07,17.48 arc-45 28.5,16.44 NC5.1 | 11.67,45.84 11.67,33.82 | NC5.1 arc45 34.44,10.56 57.05,10.56 arc45 61.71,15.23 arc-45 62.98,15.76 64.26,15.76 arc-45 66.06,15.01 NC6.1 arc-45 67.57,12.76 arc45 68.51,10.51 68.76,10.25 arc45 70.56,9.51 NEO_03.1-VDD | NEO_PWR_SEL.2 85.88,57.14 arc-45 86.62,55.35 86.62,53.86 arc-45 86.44,53.42 arc45 85.53,51.22 NC1.1 89,47.76 arc45 90.8,48.5 NEO_04.1-VDD | 28.71,78.75 28.71,64.05 arc-45 27.97,62.26 19.8,54.09 arc45 19.06,52.3 19.06,48.38 arc-90 16.52,45.84 11.67,45.84
  Bottom 0.635: v13.98,31.51 13.74,31.75 arc-45 13.72,31.79
  Bottom 0.813: 80.01,68.09 78.77,66.85 arc45 78.24,65.57 78.24,64.74 arc45 80.55,59.17 arc45 82.34,58.43 NEO_PWR_SEL.2 85.49,58.43 arc-45 91.23,44.57 arc-45 84.85,29.18 NEO_10.1-VDD arc-45 83.94,28.34 NC12.1 NC12.1 arc-45 81.29,28.36 80.78,28.36 arc45 79.12,27.67 78.11,26.66 arc45 76.72,23.31 arc-45 73.89,16.49 64.16,6.75 arc-45 61.49,5.65 NEO_09.1-VDD 49.35,6.95 47.42,8.88 | 80.01,68.09 80.52,68.6 | 21.35,81.4 arc-45 38.12,88.35 NEO_12.1-VDD 45.45,87.55 arc-45 NC8.1 | 80.01,68.09 arc45 80.22,67.6 NC7.1 80.61,68.38 arc45 80.52,68.6 | 21.35,81.4 19.51,79.56 arc45 18.04,76.03 18.04,73.55 arc-45 15.08,66.38 arc-45 13.28,65.64 | 13.28,65.64 12.2,65.64 arc45 12.46,65.75 NC9.1 | NC11.1 arc45 47.42,8.88 | 47.42,8.88 47.14,9.15 45.15,9.15 arc-45 15.64,19.51 13.72,22.93 12.72,24.64 NEO_08.1-VDD 13.86,25.78 | NC10.1 13.51,26.62 arc-45 13.86,25.78 | NC9.1 12.88,65.8 arc-45 13.28,65.64 | NC9.1 NEO_07.1-VDD 6.85,62.48 arc45 6.11,60.68 6.11,43.46 arc45 8.97,36.54 13.72,31.79 arc-45 15,28.71 15,27.97 arc-45 14.25,26.18 13.86,25.78 | 80.52,68.6 NEO_11.1-VDD | v21.35,81.29 21.35,81.4
N$10
  Top 0.635: NEO_03.2-DOUT 84.72,23.14 arc37 86.62,25.78 90.97,39.81 arc18 NEO_04.4-DIN
N$11
  Bottom 0.61: NEO_07.2-DOUT arc33 4.84,59.39 4.84,46.32 arc24 7.26,34.7 NEO_08.4-DIN
N$12
  Bottom 0.61: NEO_08.2-DOUT 9.51,22.36 18.12,13.74 arc45 37.66,5.65 NEO_09.4-DIN
N$13
  Bottom 0.61: NEO_10.4-DIN 73.11,10.99 arc-45 52.25,2.35 NEO_09.2-DOUT
N$14
  Bottom 0.635: NEO_10.2-DOUT 90.98,36.75 arc21 92.26,42.87 92.26,44.88 arc35 87.06,61.28 NEO_11.4-DIN
N$15
  Bottom 0.203: U$3.15 52.39,35.55 arc45 52,34.62 52,33.2 arc-45 51.27,31.41 50.73,30.88 arc45 50.57,30.49 R14.1
N$16
  Top 0.203: R10.2 42.33,23.63 42.33,23.38 D2.A
N$17
  Top 0.203: CTRL2.2 43.51,29.29 arc45 41.39,30.17 R14.2
N$18
  Top 0.203: CTRL1.2 59.4,27.6 57.34,29.65 arc45 55.98,30.22 R12.2
N$19
  Top 0.203: R13.2 30.41,61.76 arc-45 31.96,65.49 arc-45 38.84,68.34 Q1.G
N$20
  Top 0.813: Q1.D 41.92,70.88 42.95,69.84 arc-45 43.7,68.05 43.7,65.5 arc-45 43.19,64.27 arc-45 43.16,64.26 ACT_OUTPUT.1
  Bottom 0.813: ACT_OUTPUT.1 40.42,63.83 arc-45 39.68,62.03 39.62,61.97 arc-45 38.62,61.55 26.79,61.55 arc-45 26.04,61.87 24.17,63.73 D4.A
N$23  (via drill 0.55)
  Top 0.635: NEO_06.2-DOUT 18.4,78.26 arc27 16.15,76.17 v14.49,73.67
  Bottom 0.61: 13.32,71.57 NEO_07.4-DIN
  Bottom 0.635: v16.27,76.46 v15.25,74.94 v14.49,73.67 13.32,71.57
N$24
  Top 0.203: LED_ON.2 50.57,23.4 arc-45 52.37,24.14 66.01,24.14 arc45 67.81,24.88 70.88,27.95 arc45 71.38,29.18 71.38,30.24 71.98,30.83 arc-45 C21.2
N$25
  Top 0.813: D1.C arc-45 81.49,63.31 83.29,61.51 arc45 NEO_PWR_SEL.3
N$26
  Top 0.635: U$2.3 14.06,59.7 | 14.06,59.7 14.06,60.53 arc45 R15.1 | NEO_IN_SEL.3 14.06,59.7
N$27
  Top 0.203: R10.1 47.4,23.63 arc-45 LED_ON.1
N$28
  Top 0.203: D3.C R11.2
N$29
  Top 0.203: D5.C R17.2
N$30
  Top 0.203: D6.C R18.2
N$32  (via drill 0.35)
  Top 0.203: D3.A v57.41,66.56 | U$3.16 54.13,34.75 arc45 54.51,35.66 54.54,35.7 54.54,36.35 arc45 53.43,39.03 arc-45 52.41,41.49 52.41,56.63 arc-45 52.84,57.67 52.84,58.41 arc45 v52.69,58.77
  Bottom 0.203: v57.41,66.56 55.29,64.44 54.27,63.18 arc39 52.72,58.8 v52.69,58.77
N$33  (via drill 0.35)
  Top 0.203: U$3.18 51.73,34.89 arc45 52,35.55 52,57.88 arc45 v52.02,57.91 | v54.58,66.52 54.58,68.35 arc-45 D5.A
  Bottom 0.203: v54.58,66.52 arc-39 53.33,62.79 arc38 51.97,58.85 51.97,58.02 arc45 v52.02,57.91
N$34  (via drill 0.35)
  Top 0.203: D6.A v51.83,66.56 | U$3.22 46.77,35.01 arc45 46.92,35.38 46.92,35.91 arc-45 48.25,39.11 49.56,40.41 arc45 51.57,45.28 51.57,56.8 arc45 51.32,57.41 arc-45 51.29,57.48 v51.29,58.85
  Bottom 0.203: v51.29,58.85 51.29,59.63 arc-26 51.83,61.96 v51.83,66.56
NEO_P  (via drill 0.55)
  Top 0.203: 10.66,56.21 arc-45 R16.2
  Top 0.635: v8.44,51.05 arc45 8.39,51.17 8.39,54.11 | 8.39,54.11 NEO_IN_SEL.1 | R16.2 8.51,54.39 arc45 8.39,54.11 | U$2.2 10.66,56.21
  Bottom 0.635: U$3.40 arc-45 22.57,33.79 22.11,33.79 21.63,34.27 arc-45 21.09,35.57 arc45 19.92,38.4 9.19,49.13 arc-45 8.44,50.93 v8.44,51.05
NEO_P1
  Top 0.635: NEO_01.2-DOUT 5.65,34.26 arc45 11.23,20.8 22.52,9.51 NEO_02.4-DIN
NEO_P99
  Top 0.635: NEO_IN_SEL.2 arc45 4.75,55.65 4.6,55.5 arc45 2.35,50.07 NEO_01.4-DIN
S-PWR
  Bottom 0.813: U$7.IN 35.05,71.33 arc45 34.31,69.53 D4.C 37.14,63.73 arc45 ACT_OUTPUT.2
SCL
  Top 0.203: U$3.5 65.96,38.59 R1.1
  Bottom 0.203: R1.1 66.26,39.07 arc-45 67.54,42.15 69.71,44.32 arc-45 71.39,45.02 72.46,45.02 arc-45 74.16,44.32 U$1.SCL arc-45 74.18,43.11 74.18,43.09 arc45 75.01,41.09 75.72,40.38 arc45 77.52,39.63 SCL.P$1
SCL0
  Top 0.203: VEML_F.1 55.38,15.24 arc-45 54.59,13.33 R5.1 53.46,12.46 50.22,12.46 | I2C0.4 47.24,13.69 arc45 50.22,12.46 | SCL0.P$1 50.2,12.7 50.22,12.46 | 50.07,12.51 50.19,12.69 | 50.19,12.69 50.35,12.48 | 50.19,12.69 arc-45 50.22,12.61 50.22,12.46
  Bottom 0.203: U$1.SC0 77.97,49.86 arc90 76.51,51.32 64.55,51.32 arc45 61.91,50.22 56.24,44.55 arc45 54.51,40.37 54.51,33.86 arc-45 53.99,32.61 52.8,31.42 arc45 52.08,29.69 52.08,16.05 arc45 53.59,12.41 R5.1
SCL1
  Top 0.203: R8.1 84.86,41.52 arc-45 83.18,37.46 82.54,36.82 arc45 80.53,31.96 80.53,31.43 arc-45 79.63,29.26 78.53,28.16 | 78.53,28.16 72.88,22.51 I2C1.4 | SCL1.P$1 78.53,28.16
  Bottom 0.203: 87.73,44.43 VEML_B.1 arc-90 85.48,42.17 84.97,42.17 84.91,42.24 | 84.91,42.24 R8.1 | U$1.SC1 76.7,42.59 arc90 78.38,40.9 82.41,40.9 arc45 84.4,41.73 84.91,42.24
SDA
  Top 0.203: U$3.3 68.5,37 arc45 69.1,38.45 69.1,38.8 R2.1
  Bottom 0.203: R2.1 69.1,40.13 | U$3.3 69.1,38.86 69.1,40.13 | 69.1,40.13 69.1,42.43 arc-45 69.36,43.06 70.52,44.22 arc-45 71.31,44.55 71.91,44.55 arc-90 72.89,43.57 U$1.SDA arc-45 72.91,43.11 72.91,41.37 arc45 73.42,40.14 arc45 74.64,39.63 SDA.P$1
SDA0
  Top 0.203: R6.1 55.36,19.29 arc45 VEML_F.4 54.81,19.25 arc45 53.08,18.54 51.8,17.26 arc-45 50.02,16.52 | I2C0.3 45.12,15.67 arc-45 47.17,16.52 50.02,16.52 | SDA0.P$1 50.02,16.52
  Bottom 0.203: U$1.SD0 76.7,49.98 arc90 75.87,50.81 64.43,50.81 arc45 62.43,49.98 59.6,47.15 arc45 57.07,41.05 57.07,33.89 arc-90 55.26,32.08 54.94,32.08 arc45 53.52,31.49 53.23,31.2 arc45 52.57,29.59 52.57,25.42 arc45 53.86,22.31 R6.1
SDA1
  Top 0.203: I2C1.3 arc-45 72.42,24.32 76.22,28.12 | 76.22,28.12 76.48,28.75 arc-45 77,30.01 77.37,30.38 arc24 81.05,36.07 arc21 82.02,41.34 R7.1 | 76.22,28.12 76.11,28.05 SDA1.P$1
  Bottom 0.203: VEML_B.4 86.95,48.33 arc45 85.23,49.05 82.87,49.05 arc45 80.99,48.27 79.11,46.39 | 79.11,46.39 arc45 77.97,43.63 U$1.SD1 | R7.1 82.02,42.4 arc45 81.25,44.24 79.11,46.39
SHDN  (1 unrouted)
SOL1
  Bottom 0.203: U$3.33 30.4,38.91 30.41,38.92 arc-45 R13.1

### Text on the board
tNames: Designed by Nathan Villicana-Shaw | 2019 | 12V | 3.3V | 5V | 1 | 2 | 3 | PWR | GND | 3.x | 5V | NEO | Out | 5V | 3.3V | 10k | 4.7k | 4.7k | 3.3V | GND | BCLK | DOUT | LRCL | SEL | 2.2k | 2.2k | 4.7k | SCL | SDA | GND | 3.3V | 4.7k | 3.3V | GND | SDA | SCL
bNames: GND | PWR | 5V | GND | VIN | SHDN | SEL | LRCL | DOUT | BCLK | GND | 3.3V | 4.7k | 4.7k
tValues: 660R